# Altium schematic sheet 14 PM8916_CONTROL CLOCK.SchDoc
size 871 x 576 mm
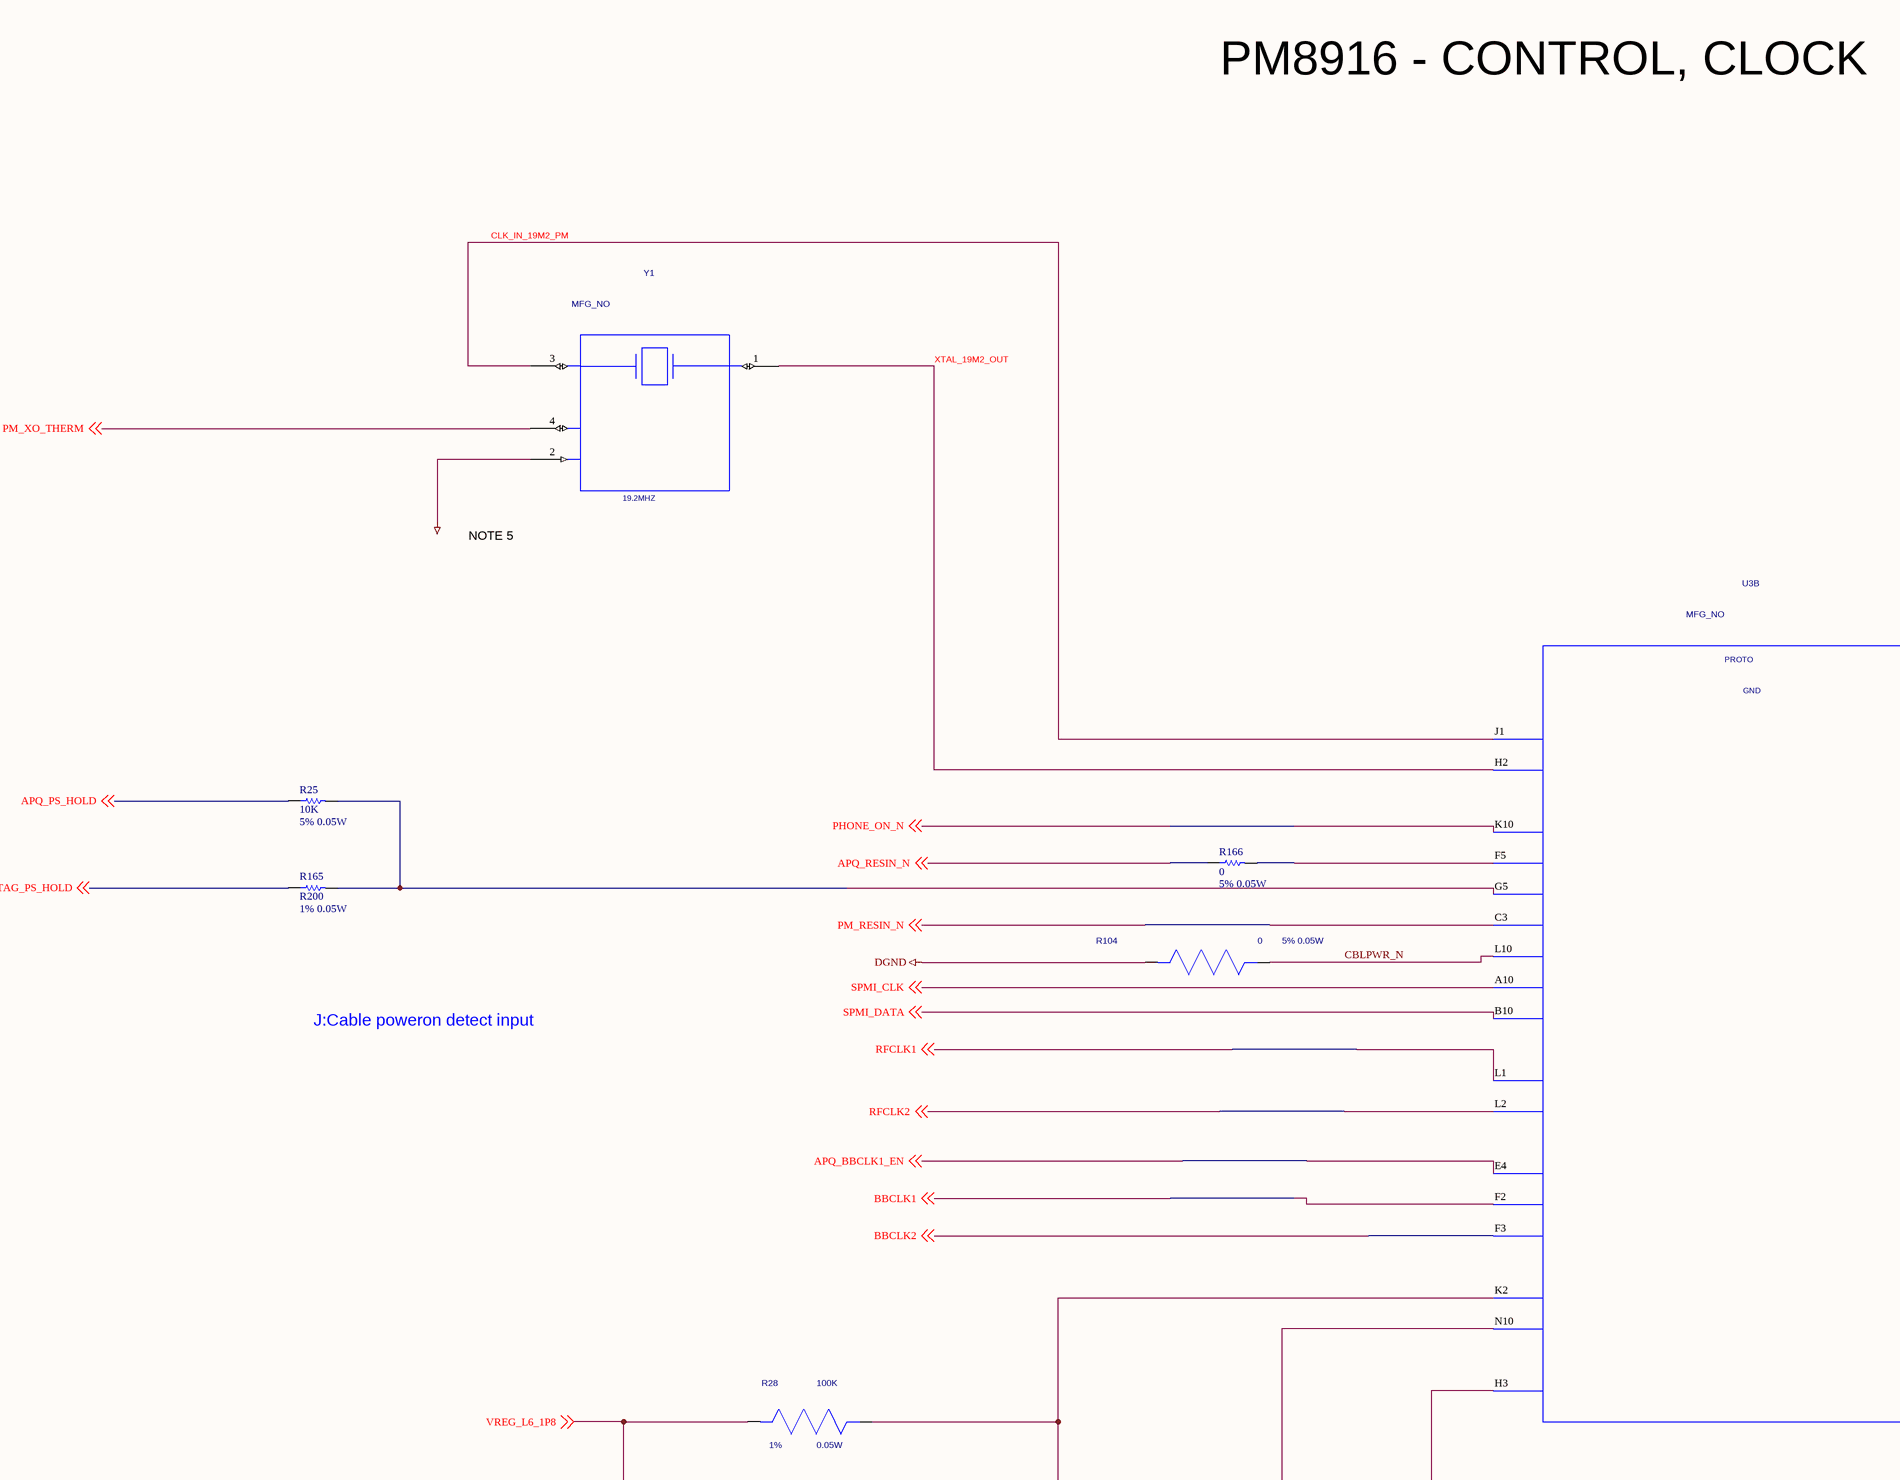
[diagram p0: 14 PM8916_CONTROL CLOCK.SchDoc, top left]
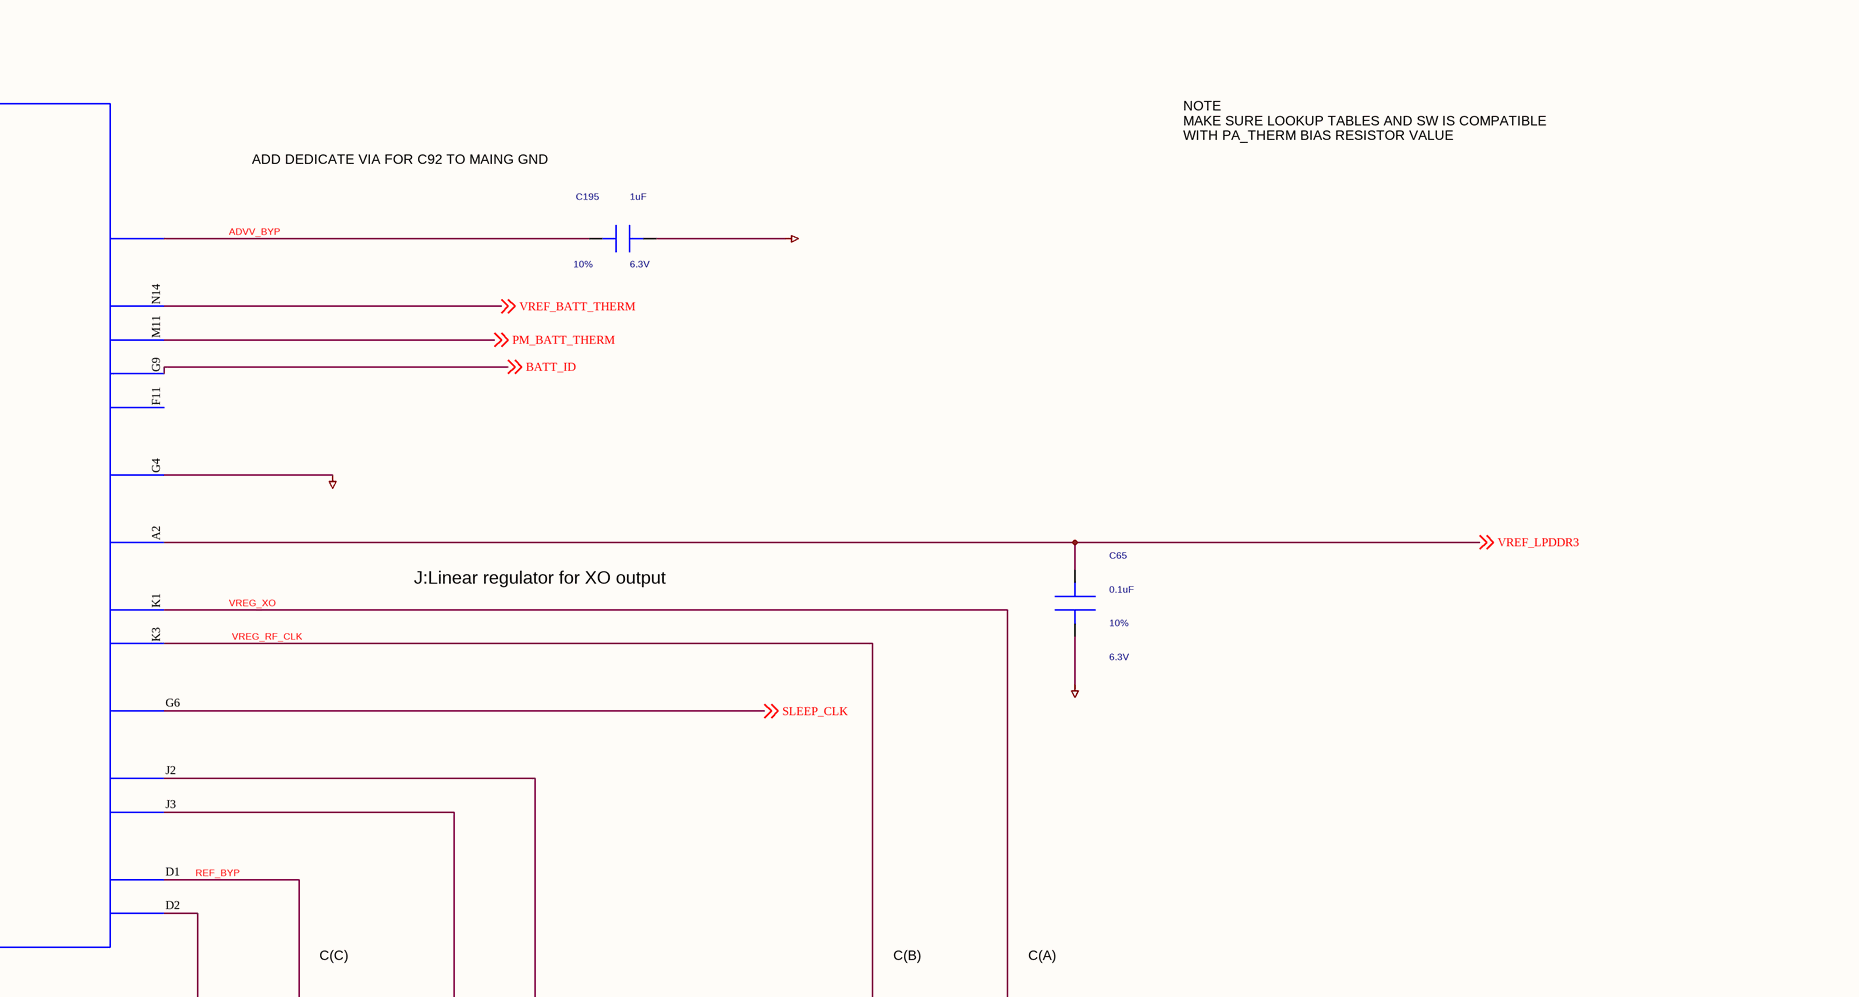
[diagram p1: 14 PM8916_CONTROL CLOCK.SchDoc, top right]
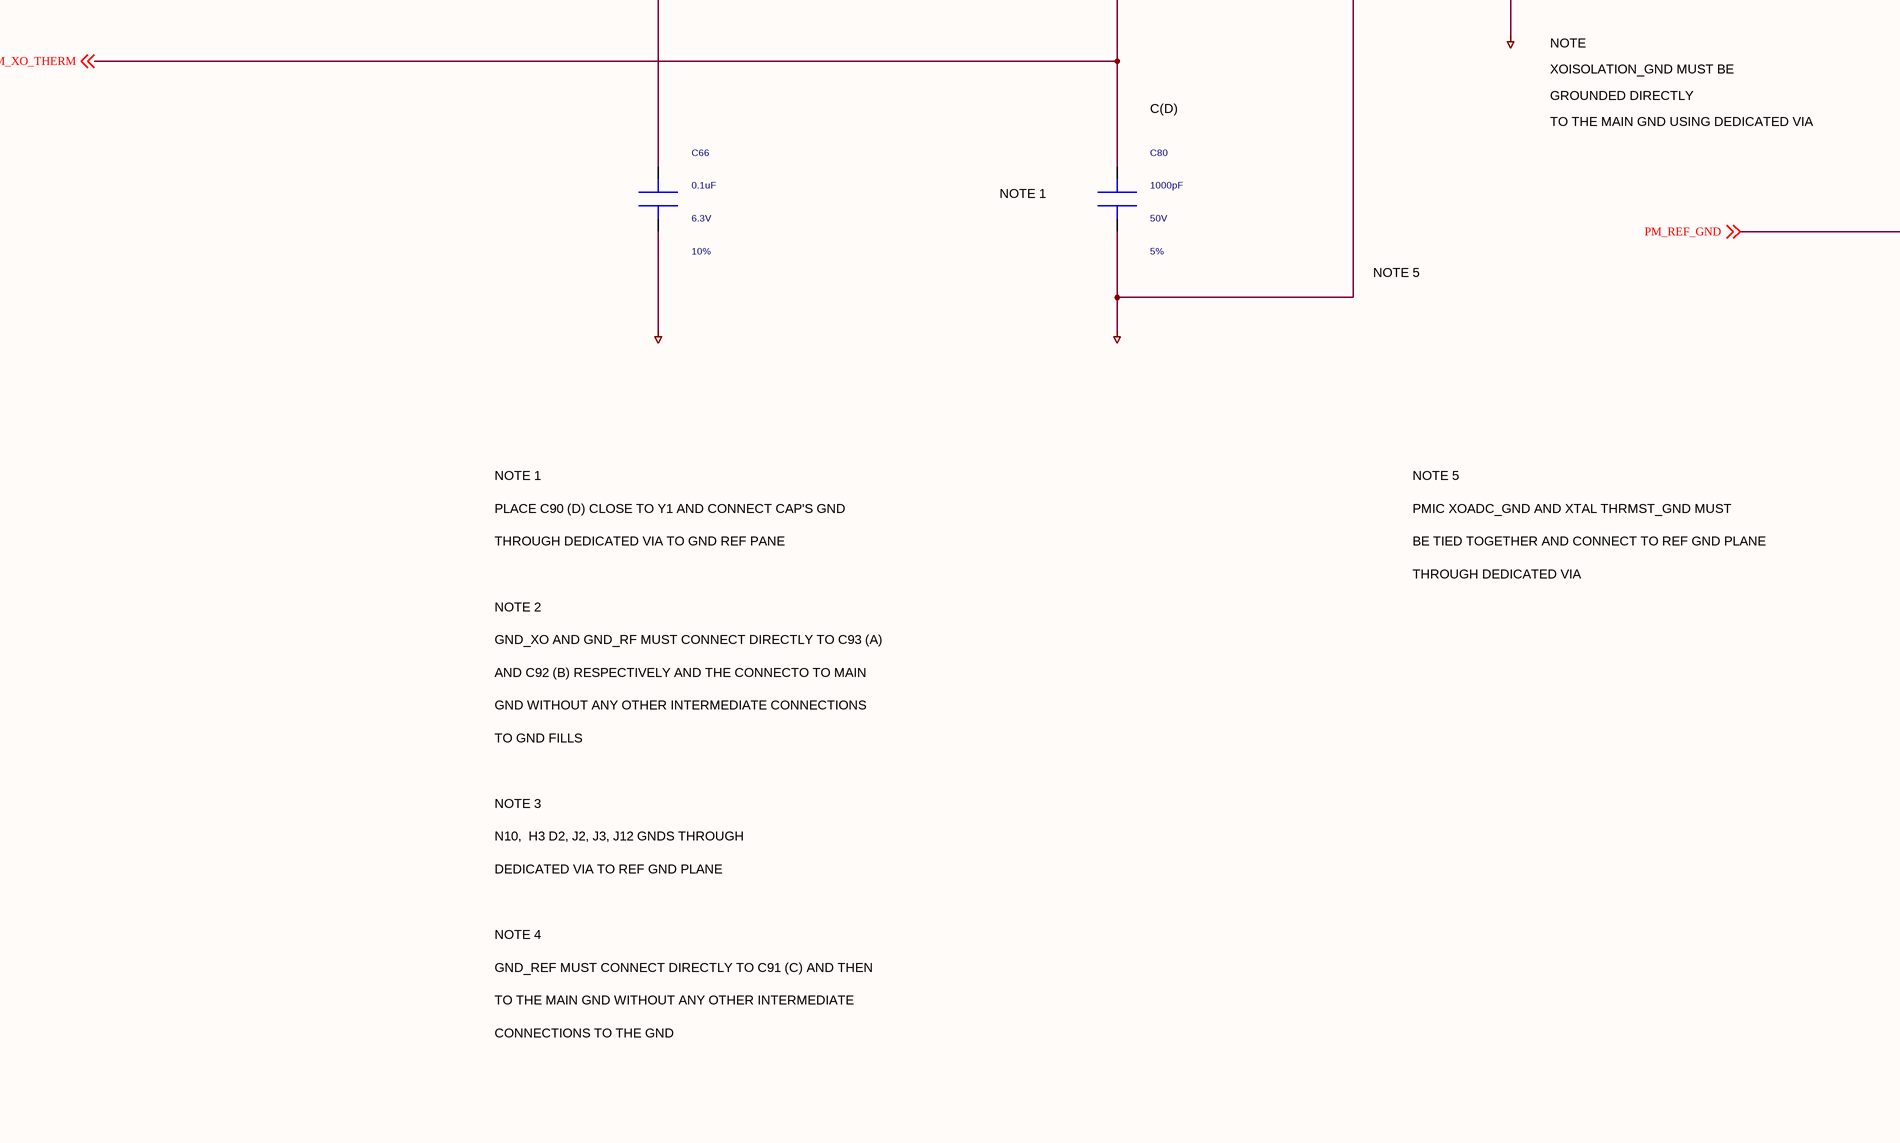
[diagram p2: 14 PM8916_CONTROL CLOCK.SchDoc, bottom left]
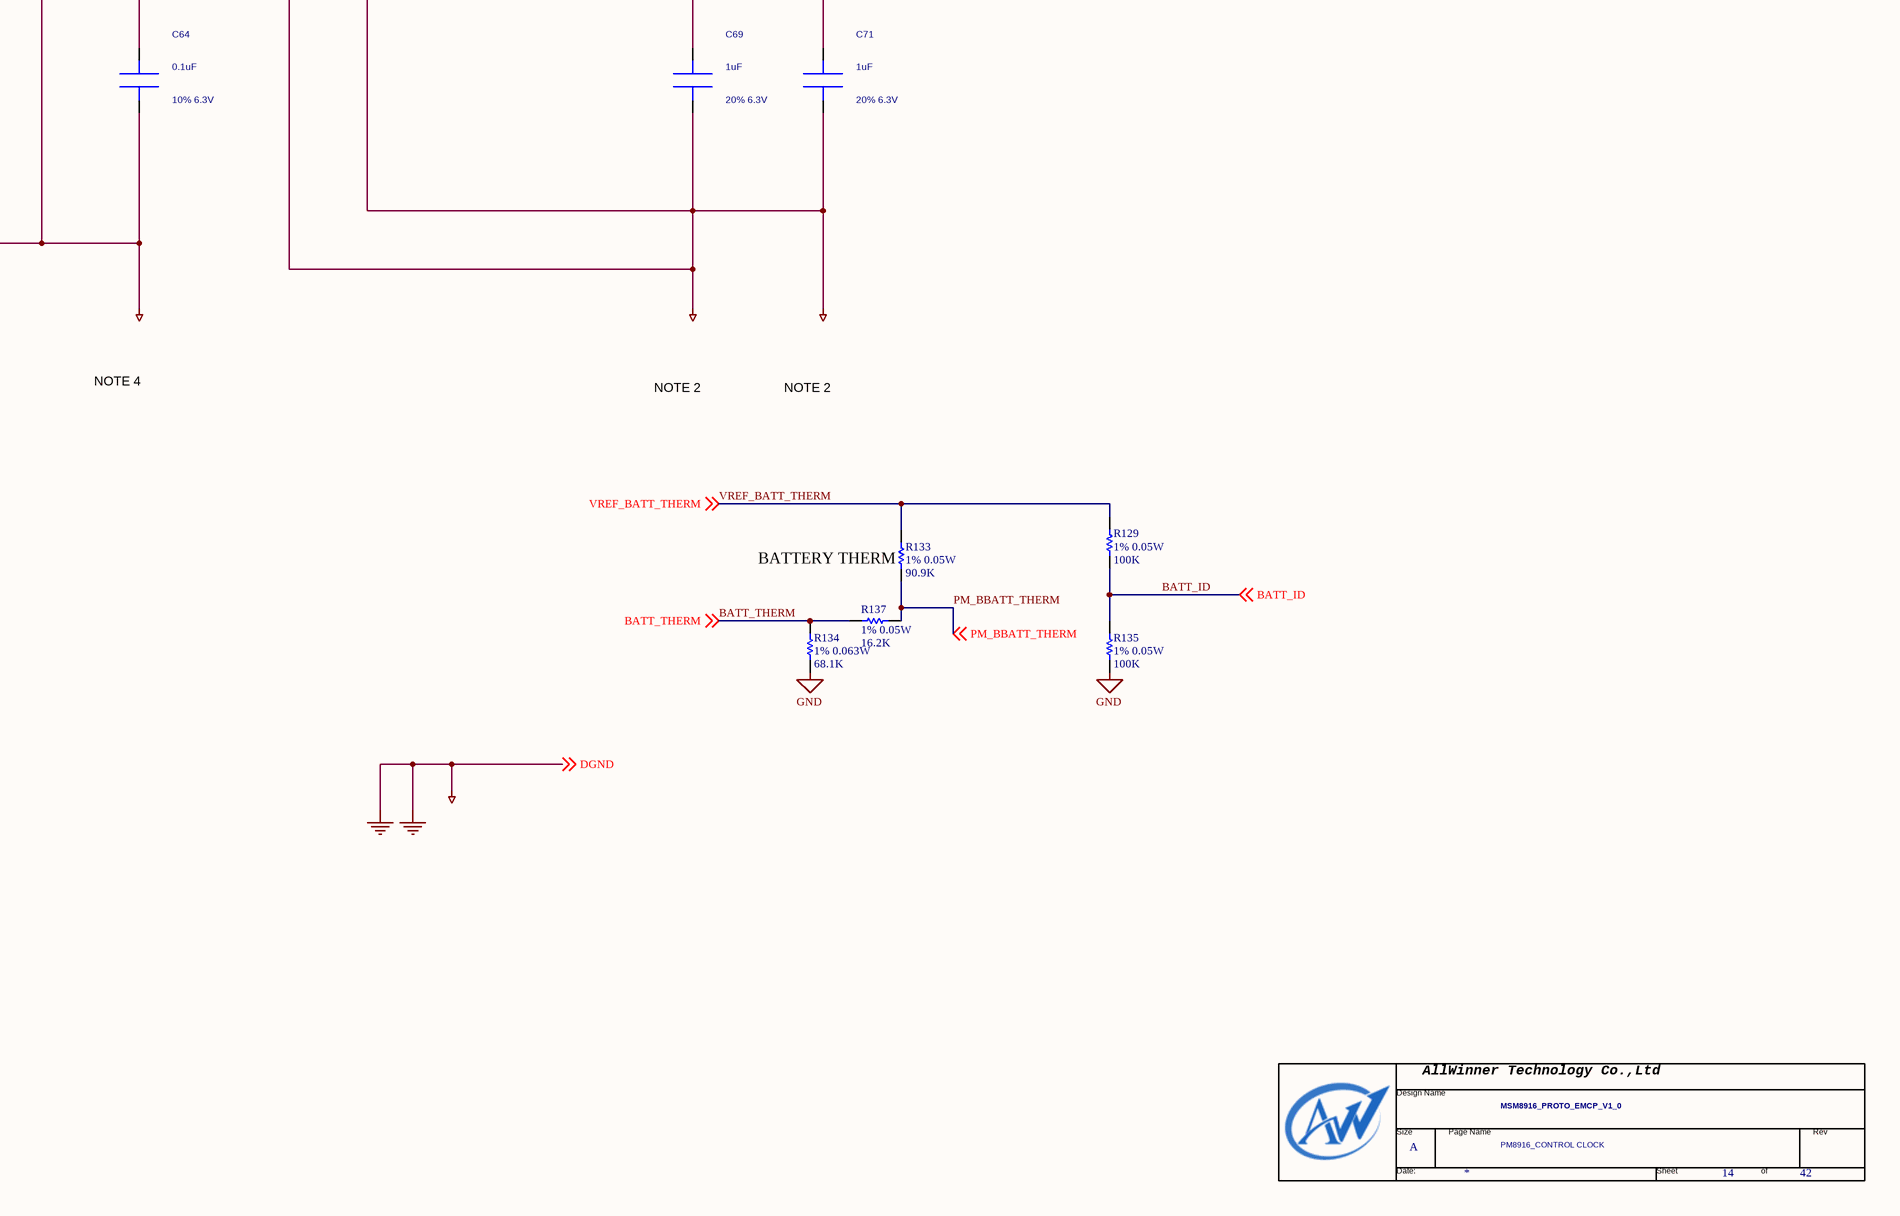
[diagram p3: 14 PM8916_CONTROL CLOCK.SchDoc, bottom right]

## Parts
*  Page Count: 42  Page Number: 14  Page Size: A  Title: MSM8916_PROTO_EMCP_V1_0  Doc: PM8916_CONTROL CLOCK  (hidden comment: TitleBlock0-AW)  (graphical)
C64  0.1uF  Tolerance: 10% 6.3V
C65  0.1uF  VOLT: 6.3V  Tolerance: 10%
C66  0.1uF  VOLT: 10%  Tolerance: 6.3V
C69  1uF  Tolerance: 20% 6.3V
C71  1uF  Tolerance: 20% 6.3V
C80  1000pF  VOLT: 5%  Tolerance: 50V
C195  1uF  VOLT: 6.3V  Tolerance: 10%
R25  10K  value 5% 0.05W  [AXIAL-0.3]
R28  100K  Tolerance: 1%  POWER: 0.05W
R104  0  POWER: 5% 0.05W
R129  1% 0.05W  value 100K  [AXIAL-0.3]
R133  1% 0.05W  value 90.9K  [AXIAL-0.3]
R134  1% 0.063W  value 68.1K  [AXIAL-0.3]
R135  1% 0.05W  value 100K  [AXIAL-0.3]
R137  1% 0.05W  value 16.2K  [AXIAL-0.3]
R165  R200  value 1% 0.05W  [AXIAL-0.3]
R166  0  value 5% 0.05W  [AXIAL-0.3]
U3  SYMNAME: GND  PART_ID: MFG_NO  BLOCKID: PROTO  [PM-8916-0-176NSP-TR-00-0]  (hidden comment: ASIC_PM8916)  (part B of 7)
Y1  PART_ID: MFG_NO  FREQ: 19.2MHZ  (hidden comment: crystal_4pin_thermistor_gnd)

## Nets
AVDD_BYP: U3.C2(AVDD_BYP)
DGND: C64.2(NEG) C65.2(NEG) C66.2(NEG) C69.2(NEG) C71.2(NEG) C80.2(NEG) C195.2(NEG) R104.1(POS) R134.1 R135.1 U3.D2(REF_GND) U3.G4(TEST_EN) U3.H3(XOISOLATION_GND) U3.J2(GND_XO) U3.J3(GND_RF) U3.N10(XOADC_GND) Y1.2(THRMSTR_GND) ; off-sheet PM_REF_GND, off-sheet DGND  [also labelled GND, PM_REF_GND]
ADVV_BYP: C195.1(POS)
APQ_BBCLK1_EN: U3.E4(BBCLK1_EN) ; off-sheet APQ_BBCLK1_EN
APQ_PS_HOLD: R25.1 ; off-sheet APQ_PS_HOLD
APQ_RESIN_N: R166.1 ; off-sheet APQ_RESIN_N
BATT_ID: R129.1 R135.2 U3.G9(BAT_ID) ; off-sheet BATT_ID
BATT_THERM: R134.2 R137.1 ; off-sheet BATT_THERM
BBCLK1: U3.F2(BBCLK1) ; off-sheet BBCLK1
BBCLK2: U3.F3(BBCLK2) ; off-sheet BBCLK2
CBLPWR_N: R104.2(NEG) U3.L10(CBLPWR*)
CLK_IN_19M2_PM: U3.J1(XTAL19M2_IN) Y1.3(H2)
JTAG_PS_HOLD: R165.1 ; off-sheet JTAG_PS_HOLD
PHONE_ON_N: U3.K10(KYPDPWR*) ; off-sheet PHONE_ON_N
PM_BATT_THERM: U3.M11(BAT_THERM) ; off-sheet PM_BATT_THERM
PM_BBATT_THERM: R133.1 R137.2 ; off-sheet PM_BBATT_THERM
PM_RESIN_N: U3.C3(RESIN*) ; off-sheet PM_RESIN_N
PM_XO_THERM: C80.1(POS) R28.2(NEG) U3.K2(XO_THERM) Y1.4(THRMSTR) ; off-sheet PM_XO_THERM
REF_BYP: C64.1(POS) U3.D1(REF_BYP)
RFCLK1: U3.L1(RFCLK1) ; off-sheet RFCLK1
RFCLK2: U3.L2(RFCLK2) ; off-sheet RFCLK2
SLEEP_CLK: U3.G6(SLEEP_CLK1) ; off-sheet SLEEP_CLK
SPMI_CLK: U3.A10(SPMI_CLK) ; off-sheet SPMI_CLK
SPMI_DATA: U3.B10(SPMI_DATA) ; off-sheet SPMI_DATA
VREF_BATT_THERM: R129.2 R133.2 U3.N14(VREF_BAT_THERM) ; off-sheet VREF_BATT_THERM
VREF_LPDDR3: C65.1(POS) U3.A2(VREF_LPDDR2) ; off-sheet VREF_LPDDR3
VREG_L6_1P8: C66.1(POS) R28.1(POS) ; off-sheet VREG_L6_1P8
VREG_RF_CLK: C69.1(POS) U3.K3(VREG_RF_CLK)
VREG_XO: C71.1(POS) U3.K1(VREG_XO)
XTAL_19M2_OUT: U3.H2(XTAL19M2_OUT) Y1.1(H1)
NetR25_2: R25.2 R165.2 U3.G5(PS_HOLD)
NetR166_2: R166.2 U3.F5(PON_RESET*)

Not connected (* = marked no-connect by the designer): U3 F11(PA_THERM)

## Notes on the sheet
- PM8916 - CONTROL, CLOCK
- NOTE 5
- ADD DEDICATE VIA FOR C92 TO MAING GND
- NOTE
  MAKE SURE LOOKUP TABLES AND SW IS COMPATIBLE
  WITH PA_THERM BIAS RESISTOR VALUE
- J:Cable poweron detect input
- J:Linear regulator for XO output
- C(C)
- C(B)
- C(A)
- NOTE
- XOISOLATION_GND MUST BE
- GROUNDED DIRECTLY
- C(D)
- TO THE MAIN GND USING DEDICATED VIA
- NOTE 1
- NOTE 4
- NOTE 2
- THROUGH DEDICATED VIA TO GND REF PANE
- PLACE C90 (D) CLOSE TO Y1 AND CONNECT CAP'S GND
- BE TIED TOGETHER AND CONNECT TO REF GND PLANE
- PMIC XOADC_GND AND XTAL THRMST_GND MUST
- BATTERY THERM
- THROUGH DEDICATED VIA
- GND_XO AND GND_RF MUST CONNECT DIRECTLY TO C93 (A)
- AND C92 (B) RESPECTIVELY AND THE CONNECTO TO MAIN
- TO GND FILLS
- GND WITHOUT ANY OTHER INTERMEDIATE CONNECTIONS
- NOTE 3
- N10,  H3 D2, J2, J3, J12 GNDS THROUGH
- DEDICATED VIA TO REF GND PLANE
- TO THE MAIN GND WITHOUT ANY OTHER INTERMEDIATE
- GND_REF MUST CONNECT DIRECTLY TO C91 (C) AND THEN
- CONNECTIONS TO THE GND
- (in symbol TitleBlock0-AW) AllWinner Technology Co.,Ltd; Design Name; Size; Page Name; Rev; Date:; Sheet; of

## Library data of the parts
C64 C69 C71 = CAP: PART_NUMBER: MCN_NO; PART_ID: MFG_NO; OriginalSymbolOrigin: (-100,75); VOLT: ?V; CDS_LMAN_SYM_OUTLINE: -75,25,75,-25; SYMNAME: CAP; PACK_TYPE: ?
C65 C66 C80 = CAP: PART_NUMBER: MCN_NO; PART_ID: MFG_NO; OriginalSymbolOrigin: (-100,75); CDS_LMAN_SYM_OUTLINE: -75,25,75,-25; SYMNAME: CAP; PACK_TYPE: ?
C195 = CAP#1: PART_NUMBER: MCN_NO; PART_ID: MFG_NO; OriginalSymbolOrigin: (-75,50); SYMNAME: CAP; CDS_LMAN_SYM_OUTLINE: -25,50,25,-50; PACK_TYPE: ?
R25 R129 R133-R135 R137 R165 R166 = Res1: Resistor; Published: 8-Jun-2000; LatestRevisionDate: 17-Jul-2002; LatestRevisionNote: Re-released for DXP Platform.; PackageReference: AXIAL-0.3; Publisher: Altium Limited; PackageDescription: Axial Device, Thru-Hole; 2 Leads; 0.3 in Pin Spacing
R28 = RESISTOR_Dup3: PART_NUMBER: MCN_NO; PART_ID: MFG_NO; OriginalSymbolOrigin: (-200,50); CDS_LMAN_SYM_OUTLINE: -150,50,150,-50; SYMNAME: resistor; PACK_TYPE: ?
R104 = RESISTOR_Dup3: PART_NUMBER: MCN_NO; PART_ID: MFG_NO; OriginalSymbolOrigin: (-200,50); Tolerance: ?%; CDS_LMAN_SYM_OUTLINE: -150,50,150,-50; SYMNAME: resistor; PACK_TYPE: ?
U3 = ASIC_PM8916: PART_NUMBER: MCN_NO; OriginalSymbolOrigin: (-1050,1125); SPLIT_INST: TRUE; CDS_LMAN_SYM_OUTLINE: -850,1125,875,-1250; CDS_LMAN_SPLIT_NUMBER: 1 of 7; PACK_TYPE: ?
Y1 = CRYSTAL_4PIN_THERMISTOR_GND: PART_NUMBER: MCN_NO; OriginalSymbolOrigin: (-350,150); CDS_LMAN_SYM_OUTLINE: -300,125,300,-500; SYMNAME: crystal_4pin_thermistor_gnd; PACK_TYPE: ?
* = TitleBlock0-AW: RevCode: ?; Page Create Date: March  8, 1995; Page Modify Date: *